# EAGLE schematic Teensy3 (EAGLE 6.4)
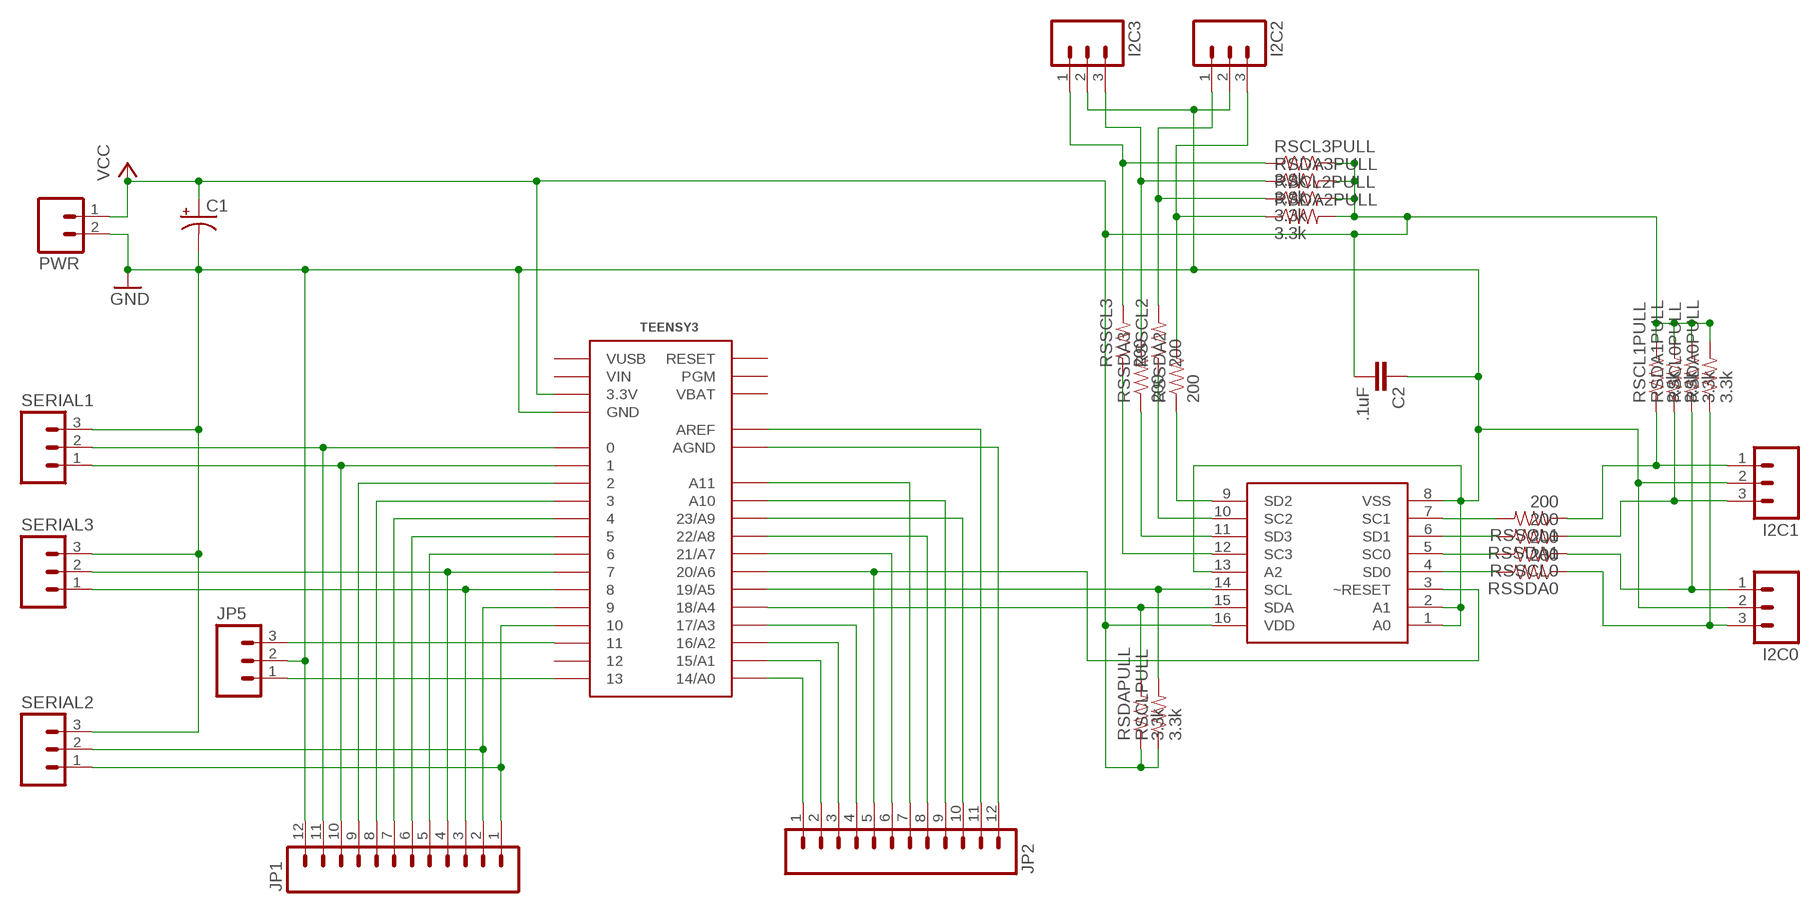
[diagram p0: schematic, sheet 1]

## Parts
C1  CAP_POLPTH1  [CPOL-RADIAL-100UF-25V]
C2  .1uF  CAP0805  [0805]
I2C0  M03SCREW  [SCREWTERMINAL-3.5MM-3]
I2C1  M03SCREW  [SCREWTERMINAL-3.5MM-3]
I2C2  M03SCREW  [SCREWTERMINAL-3.5MM-3]
I2C3  M03SCREW  [SCREWTERMINAL-3.5MM-3]
IC1  PCA9646SO16  [SO16]
JP1  M12LOCK  [1X12_LOCK]
JP2  M12LOCK  [1X12_LOCK]
JP5  M03SCREW  [SCREWTERMINAL-3.5MM-3]
PWR  M02POLAR_LOCK  [MOLEX-1X2_LOCK]
RSCL0PULL  3.3k  RESISTOR0603-RES  [0603-RES]
RSCL1PULL  3.3k  RESISTOR0603-RES  [0603-RES]
RSCL2PULL  3.3k  RESISTOR0603-RES  [0603-RES]
RSCL3PULL  3.3k  RESISTOR0603-RES  [0603-RES]
RSCLPULL  3.3k  RESISTOR0603-RES  [0603-RES]
RSDA0PULL  3.3k  RESISTOR0603-RES  [0603-RES]
RSDA1PULL  3.3k  RESISTOR0603-RES  [0603-RES]
RSDA2PULL  3.3k  RESISTOR0603-RES  [0603-RES]
RSDA3PULL  3.3k  RESISTOR0603-RES  [0603-RES]
RSDAPULL  3.3k  RESISTOR0603-RES  [0603-RES]
RSSCL0  200  RESISTOR0603-RES  [0603-RES]
RSSCL1  200  RESISTOR0603-RES  [0603-RES]
RSSCL2  200  RESISTOR0603-RES  [0603-RES]
RSSCL3  200  RESISTOR0603-RES  [0603-RES]
RSSDA0  200  RESISTOR0603-RES  [0603-RES]
RSSDA1  200  RESISTOR0603-RES  [0603-RES]
RSSDA2  200  RESISTOR0603-RES  [0603-RES]
RSSDA3  200  RESISTOR0603-RES  [0603-RES]
SERIAL1  M03LOCK  [1X03_LOCK]
SERIAL2  M03LOCK  [1X03_LOCK]
SERIAL3  M03LOCK  [1X03_LOCK]
TEENSY3  TEENSY_3.0+4  [TEENSY_3.0+4]

## Nets
GND: C1.2(-) C2.1 I2C0.2 I2C1.2 I2C2.2 I2C3.2 IC1.1(A0) IC1.2(A1) IC1.8(VSS) IC1.13(A2) JP1.12 JP5.2 PWR.2 SERIAL1.3 SERIAL2.3 SERIAL3.3 TEENSY3.GND TEENSY3.GND1(GND)
N$1: IC1.12(SC3) RSSCL3.1
N$2: IC1.11(SD3) RSSDA3.1
N$3: IC1.10(SC2) RSSCL2.1
N$4: JP1.1 SERIAL2.1 TEENSY3.10
N$5: IC1.9(SD2) RSSDA2.1
N$6: IC1.7(SC1) RSSCL1.2
N$7: IC1.6(SD1) RSSDA1.2
N$8: IC1.5(SC0) RSSCL0.2
N$9: IC1.4(SD0) RSSDA0.2
N$10: JP1.2 SERIAL2.2 TEENSY3.9
N$11: JP1.4 SERIAL3.2 TEENSY3.7
N$12: JP1.3 SERIAL3.1 TEENSY3.8
N$13: IC1.3(~RESET) JP2.5 TEENSY3.20/A6
N$14: JP5.3 TEENSY3.11
N$15: JP1.5 TEENSY3.6
N$16: JP1.6 TEENSY3.5
N$17: JP1.7 TEENSY3.4
N$18: JP1.8 TEENSY3.3
N$19: JP1.9 TEENSY3.2
N$20: JP2.1 TEENSY3.14/A0
N$21: JP2.2 TEENSY3.15/A1
N$22: JP5.1 TEENSY3.13
N$23: JP2.3 TEENSY3.16/A2
N$24: JP2.4 TEENSY3.17/A3
N$25: JP2.6 TEENSY3.21/A7
N$26: JP2.7 TEENSY3.A11
N$27: JP2.8 TEENSY3.22/A8
N$28: JP2.9 TEENSY3.A10
N$29: JP2.10 TEENSY3.23/A9
N$30: JP2.12 TEENSY3.AGND
N$31: JP2.11 TEENSY3.AREF
RX1: JP1.11 SERIAL1.2 TEENSY3.0
SCL: IC1.14(SCL) RSCLPULL.2 TEENSY3.19/A5
SCL0: I2C0.1 RSCL0PULL.1 RSSCL0.1
SCL1: I2C1.1 RSCL1PULL.1 RSSCL1.1
SCL2: I2C2.1 RSCL2PULL.1 RSSCL2.2
SCL3: I2C3.1 RSCL3PULL.1 RSSCL3.2
SDA: IC1.15(SDA) RSDAPULL.2 TEENSY3.18/A4
SDA0: I2C0.3 RSDA0PULL.1 RSSDA0.1
SDA1: I2C1.3 RSDA1PULL.1 RSSDA1.1
SDA2: I2C2.3 RSDA2PULL.1 RSSDA2.2
SDA3: I2C3.3 RSDA3PULL.1 RSSDA3.2
TX1: JP1.10 SERIAL1.1 TEENSY3.1
VCC: C1.1(+) C2.2 IC1.16(VDD) PWR.1 RSCL0PULL.2 RSCL1PULL.2 RSCL2PULL.2 RSCL3PULL.2 RSCLPULL.1 RSDA0PULL.2 RSDA1PULL.2 RSDA2PULL.2 RSDA3PULL.2 RSDAPULL.1 TEENSY3.3.3V TEENSY3.3.3V1(3.3V)
Unconnected: TEENSY3.12 TEENSY3.PGM TEENSY3.RESET

## Power pins joined to a net without a drawn wire
VBAT: TEENSY3.VBAT
VIN: TEENSY3.VIN
VUSB: TEENSY3.VUSB

## Library data of the parts
C1 = SparkFun-Passives:CAP_POL: Capacitor Polarized These are standard SMD and PTH capacitors. Normally 10uF, 47uF, and 100uF in electrolytic and tantalum varieties. Always verify the external diameter of the through hole cap, it varies with capacity, voltage, and manufacturer. The EIA devices should be standard.
C2 = SparkFun-Capacitors:CAP: Capacitor Standard 0603 ceramic capacitor, and 0.1" leaded capacitor.
I2C0 I2C1-I2C3 JP5 SERIAL1-SERIAL3 = SparkFun-Connectors:M03: Header 3 Standard 3-pin 0.1" header. Use with straight break away headers (SKU : PRT-00116), right angle break away headers (PRT-00553), swiss pins (PRT-00743), machine pins (PRT-00117), and female headers (PRT-00115). Molex polarized connector foot print use with SKU : PRT-08232 with associated crimp pins and housings.
IC1 = personal:PCA9646
JP1 JP2 = SparkFun-Connectors:M12: Header 12 Standard 12-pin 0.1" header. Use with straight break away headers (SKU : PRT-00116), right angle break away headers (PRT-00553), swiss pins (PRT-00743), machine pins (PRT-00117), and female headers (PRT-00115).
PWR = SparkFun-Connectors:M02: Header 2 Standard 2-pin 0.1" header. Use with straight break away headers (SKU : PRT-00116), right angle break away headers (PRT-00553), swiss pins (PRT-00743), machine pins (PRT-00117), and female headers (PRT-00115). Molex polarized connector foot print use with SKU : PRT-08233 with associated crimp pins and housings.
RSCL0PULL RSCL1PULL RSCL2PULL RSCL3PULL RSCLPULL RSDA0PULL RSDA1PULL RSDA2PULL RSDA3PULL RSDAPULL RSSCL0 RSSCL1-RSSCL3 RSSDA0 RSSDA1-RSSDA3 = SparkFun-Passives:RESISTOR: Resistor Basic schematic elements and footprints for 0603, 1206, and PTH resistors.
TEENSY3 = Teensy3.0:TEENSY_3.0+4: Teensy 3.0 board, showing all pins that are easily acessible. See 'AllAnalogPins" and 'AllPins' packages for additional pin holes, as needed. The 'Basic' package has fewer pins.